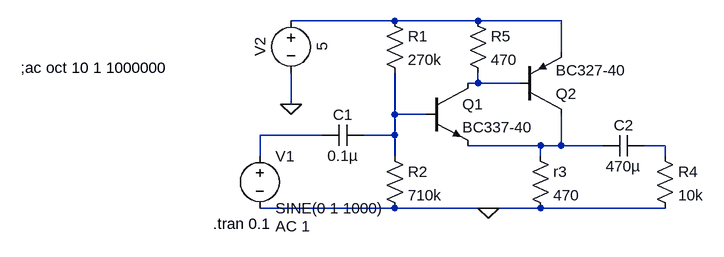
[diagram p0: schematic OutputBuffer.asc]
OutputBuffer.asc, the LTspice schematic file:
Version 4
SHEET 1 880 680
WIRE 192 0 32 0
WIRE 320 0 192 0
WIRE 448 0 320 0
WIRE 448 48 448 0
WIRE 320 96 320 80
WIRE 320 96 304 96
WIRE 384 96 320 96
WIRE 32 128 32 80
WIRE 192 144 192 80
WIRE 240 144 192 144
WIRE 80 176 -16 176
WIRE 192 176 192 144
WIRE 192 176 144 176
WIRE 416 192 304 192
WIRE 448 192 448 144
WIRE 448 192 416 192
WIRE 512 192 448 192
WIRE 608 192 576 192
WIRE -16 208 -16 176
WIRE 192 208 192 176
WIRE 416 208 416 192
WIRE 608 208 608 192
WIRE 192 288 -16 288
WIRE 336 288 192 288
WIRE 416 288 336 288
WIRE 608 288 416 288
FLAG 32 128 0
FLAG 336 288 0
SYMBOL res 176 -16 R0
SYMATTR InstName R1
SYMATTR Value 270k
SYMBOL res 176 192 R0
SYMATTR InstName R2
SYMATTR Value 710k
SYMBOL cap 144 160 R90
WINDOW 0 0 32 VBottom 2
WINDOW 3 32 32 VTop 2
SYMATTR InstName C1
SYMATTR Value 0.1µ
SYMBOL npn 240 96 R0
SYMATTR InstName Q1
SYMATTR Value BC337-40
SYMBOL pnp 384 144 M180
SYMATTR InstName Q2
SYMATTR Value BC327-40
SYMBOL cap 576 176 R90
WINDOW 0 0 32 VBottom 2
WINDOW 3 32 32 VTop 2
SYMATTR InstName C2
SYMATTR Value 470µ
SYMBOL res 592 192 R0
SYMATTR InstName R4
SYMATTR Value 10k
SYMBOL voltage -16 192 R0
WINDOW 123 24 124 Left 2
WINDOW 39 0 0 Left 0
SYMATTR Value2 AC 1
SYMATTR InstName V1
SYMATTR Value SINE(0 1 1000)
SYMBOL voltage 32 -16 R0
WINDOW 0 -32 56 VBottom 2
WINDOW 3 32 56 VTop 2
WINDOW 123 0 0 Left 0
WINDOW 39 0 0 Left 0
SYMATTR InstName V2
SYMATTR Value 5
SYMBOL res 400 192 R0
SYMATTR InstName r3
SYMATTR Value 470
SYMBOL res 304 -16 R0
SYMATTR InstName R5
SYMATTR Value 470
TEXT -88 312 Left 2 !.tran 0.1
TEXT -384 72 Left 2 !;ac oct 10 1 1000000

The netlist it stands for:
* OutputBuffer.asc
R1 N001 N003 270k
R2 N003 0 710k
C1 N003 N004 0.1µ
Q1 N002 N003 N005 0 BC337-40
Q2 N005 N002 N001 0 BC327-40
C2 N006 N005 470µ
R4 N006 0 10k
V1 N004 0 SINE(0 1 1000) AC 1
V2 N001 0 5
r3 N005 0 470
R5 N001 N002 470
.model NPN NPN
.model PNP PNP
.lib standard.bjt
.tran 0.1
;ac oct 10 1 1000000
.backanno
.end